# EAGLE design rt-board (EAGLE 5.10)
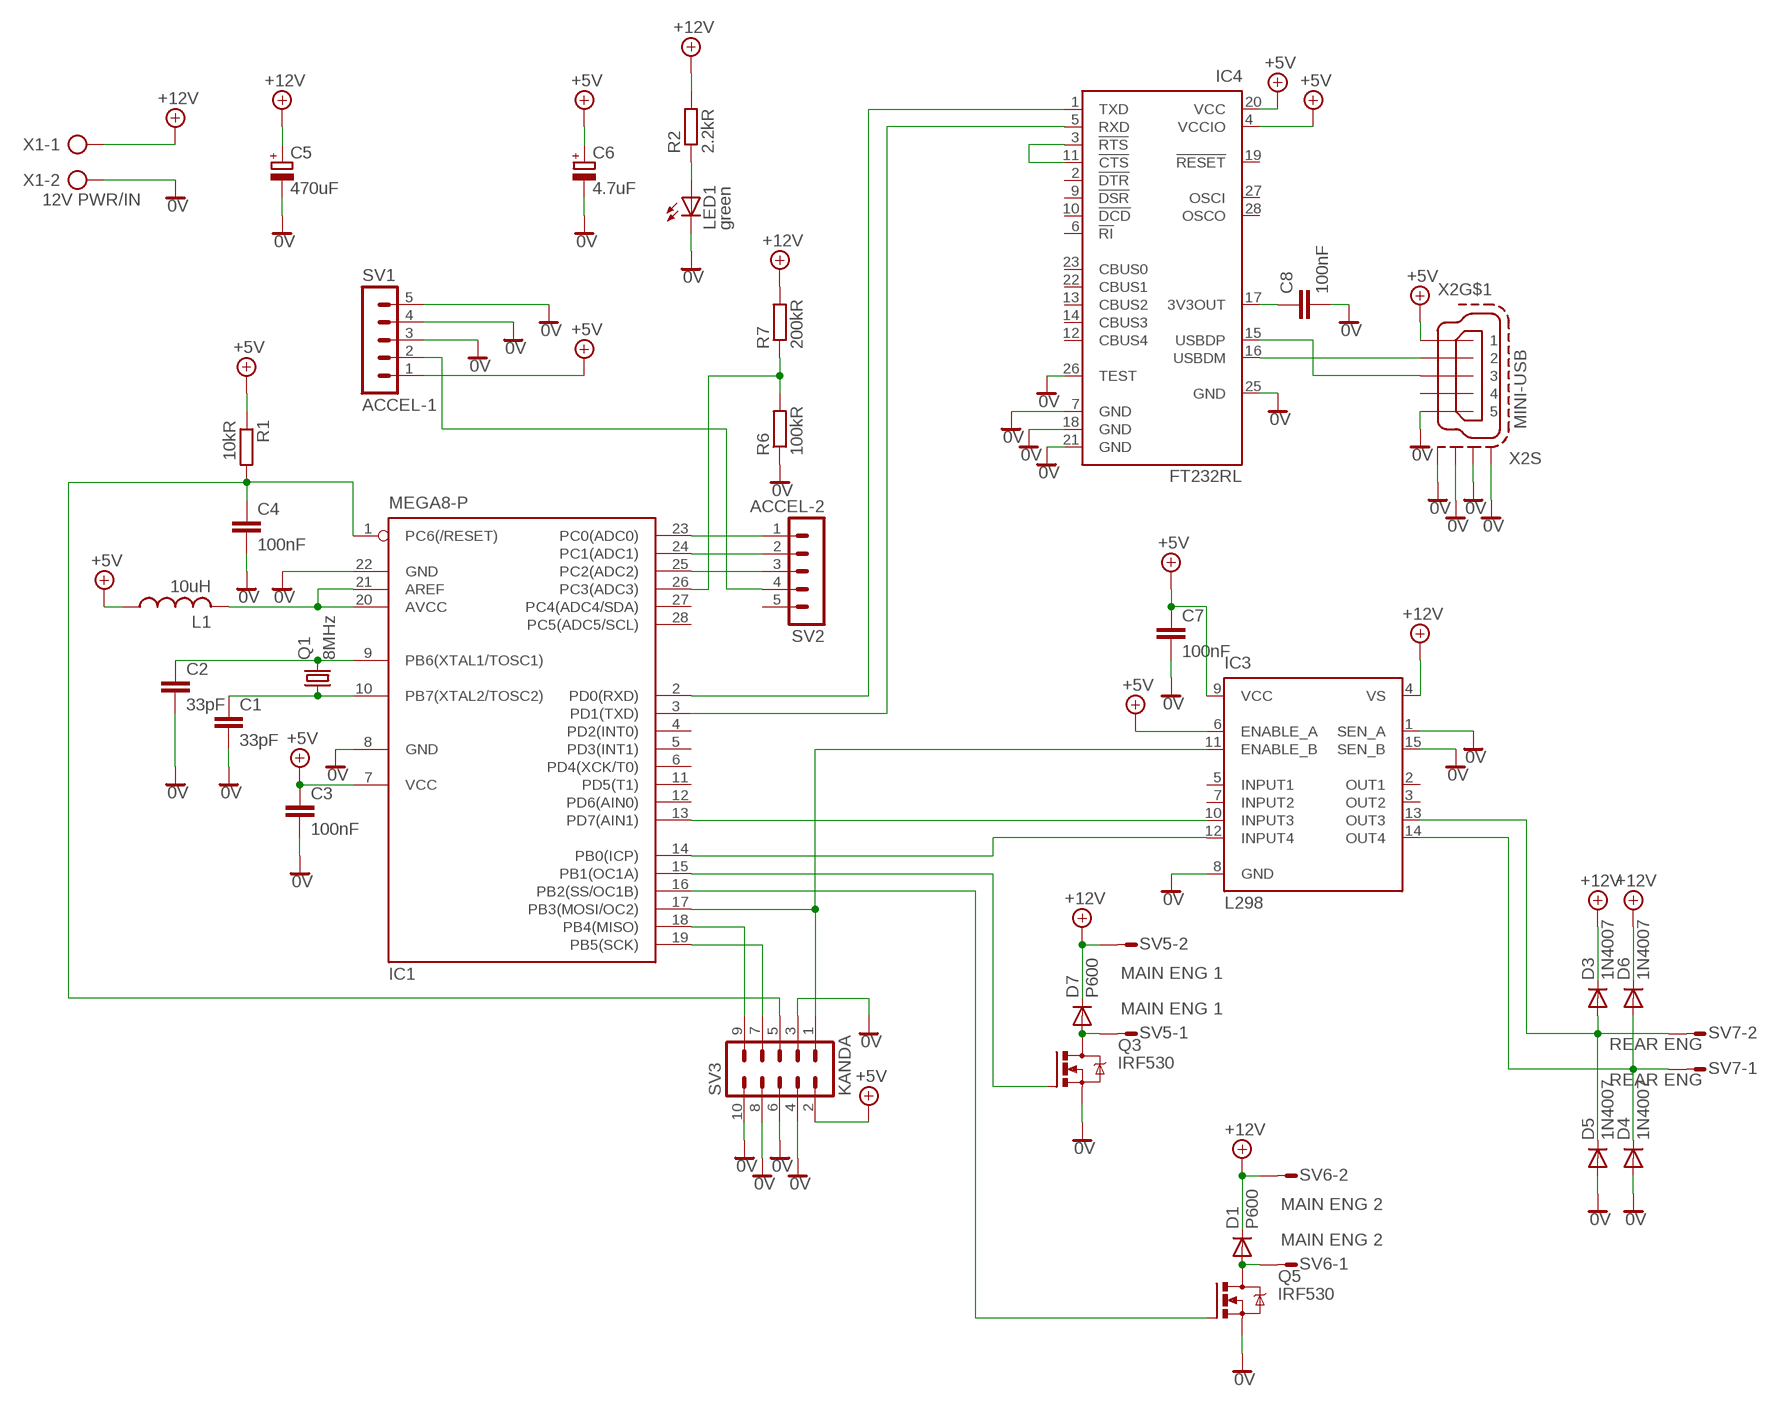
[diagram p0: schematic, sheet 1]

## Parts
C1  33pF  C-EU050-024X044  [C050-024X044]
C2  33pF  C-EU050-024X044  [C050-024X044]
C3  100nF  C-EU050-024X044  [C050-024X044]
C4  100nF  C-EU050-024X044  [C050-024X044]
C5  470uF  CPOL-EUE3.5-10  [E3,5-10]
C6  4.7uF  CPOL-EUE2-4  [E2-4]
C7  100nF  C-EU050-024X044  [C050-024X044]
C8  100nF  C-EUC0603  [C0603]
D1  P600  [P6-15]
D3  1N4007  1N4446  [DO35-10]
D4  1N4007  1N4446  [DO35-10]
D5  1N4007  1N4446  [DO35-10]
D6  1N4007  1N4446  [DO35-10]
D7  P600  [P6-15]
IC1  MEGA8-P  [DIL28-3]
IC3  L298  [MULTIWATT-15]
IC4  FT232RL  [SSOP28]
L1  10uH  L-US0204/7  [0204/7]
LED1  green  LED3MM  [LED3MM]
Q1  8MHz  CRYSTALHC49S  [HC49/S]
Q3  IRF530  [TO220BV]
Q5  IRF530  [TO220BV]
R1  10kR  R-EU_0204/5  [0204/5]
R2  2.2kR  R-EU_0204/5  [0204/5]
R6  100kR  R-EU_0204/5  [0204/5]
R7  200kR  R-EU_0204/5  [0204/5]
SV1  ACCEL-1  MA05-1  [MA05-1]
SV2  ACCEL-2  MA05-1  [MA05-1]
SV3  KANDA  ML10  [ML10]
SV5  MAIN ENG 1  S02P  [S02P]
SV6  MAIN ENG 2  S02P  [S02P]
SV7  REAR ENG  S02P  [S02P]
X1  12V PWR/IN  AK300/2  [AK300/2]
X2  MINI-USB  MINI-USB-SCHIELD-32005-201  [32005-201]

## Nets
0V: C1.2 C2.2 C3.2 C4.2 C5.- C6.- C7.2 C8.2 D4.A D5.A IC1.8(GND) IC1.22(GND) IC3.1(SEN_A) IC3.8(GND) IC3.15(SEN_B) IC4.7(GND) IC4.18(GND) IC4.21(GND) IC4.25(GND) IC4.26(TEST) LED1.K(C) Q3.S Q5.S R6.1 SV1.3 SV1.4 SV1.5 SV3.3 SV3.4 SV3.6 SV3.8 SV3.10 X1.2 X2.5 X2.M1(S:S1) X2.M2(S:S2) X2.M3(S:S3) X2.M4(S:S4)
+5V: C3.1 C6.+ C7.1 IC1.7(VCC) IC3.6(ENABLE_A) IC3.9(VCC) IC4.4(VCCIO) IC4.20(VCC) L1.1 R1.1 SV1.1 SV3.2 X2.1
+8V: C5.+ D1.C D3.C D6.C D7.C IC3.4(VS) R2.2 R7.2 SV5.2 SV6.2 X1.1 ; supply symbol labelled +12V
N$1: IC1.23(PC0(ADC0)) SV2.1
N$2: IC1.24(PC1(ADC1)) SV2.2
N$3: IC1.25(PC2(ADC2)) SV2.3
N$4: C2.1 IC1.9(PB6(XTAL1/TOSC1)) Q1.2
N$5: C1.1 IC1.10(PB7(XTAL2/TOSC2)) Q1.1
N$6: IC1.20(AVCC) IC1.21(AREF) L1.2
N$7: C4.1 IC1.1(PC6(/RESET)) R1.2 SV3.5
N$8: IC1.18(PB4(MISO)) SV3.9
N$9: IC1.19(PB5(SCK)) SV3.7
N$11: IC1.17(PB3(MOSI/OC2)) IC3.11(ENABLE_B) SV3.1
N$13: IC1.2(PD0(RXD)) IC4.1(TXD)
N$14: IC1.3(PD1(TXD)) IC4.5(RXD)
N$15: D7.A Q3.D SV5.1
N$16: D3.A D5.C IC3.13(OUT3) SV7.2
N$17: D4.C D6.A IC3.14(OUT4) SV7.1
N$18: IC1.16(PB2(SS/OC1B)) Q5.G
N$19: IC1.15(PB1(OC1A)) Q3.G
N$20: IC1.14(PB0(ICP)) IC3.12(INPUT4)
N$21: IC1.13(PD7(AIN1)) IC3.10(INPUT3)
N$22: SV1.2 SV2.4
N$23: LED1.A R2.1
N$24: IC1.26(PC3(ADC3)) R6.2 R7.1
N$25: C8.1 IC4.17(3V3OUT)
N$26: IC4.3(!RTS) IC4.11(!CTS)
N$27: IC4.16(USBDM) X2.2
N$28: IC4.15(USBDP) X2.3
N$30: D1.A Q5.D SV6.1
Unconnected: IC1.4(PD2(INT0)) IC1.5(PD3(INT1)) IC1.6(PD4(XCK/T0)) IC1.11(PD5(T1)) IC1.12(PD6(AIN0)) IC1.27(PC4(ADC4/SDA)) IC1.28(PC5(ADC5/SCL)) IC3.2(OUT1) IC3.3(OUT2) IC3.5(INPUT1) IC3.7(INPUT2) IC4.2(!DTR) IC4.6(!RI) IC4.9(!DSR) IC4.10(!DCD) IC4.12(CBUS4) IC4.13(CBUS2) IC4.14(CBUS3) IC4.19(!RESET) IC4.22(CBUS1) IC4.23(CBUS0) IC4.27(OSCI) IC4.28(OSCO) SV2.5 X2.4

## Library data of the parts
C1-C4 C7 C8 = rcl:C-EU: CAPACITOR, European symbol
C5 C6 = rcl:CPOL-EU: POLARIZED CAPACITOR, European symbol
D1 D7 = diode:P600: DIODE high voltage diode, silicon rectifier 1.0 A to 6.0 A, 50 V to 1300 V http://www.kosemi.com/product/diosr.html
D3-D6 = diode:1N4446: DIODE high speed (Philips)
IC1 = atmel:MEGA8-P: MICROCONTROLLER 8 Kbytes FLASH, 1 kbytes SRAM, 512 bytes EEPROM, USART, 4-channel 10 bit ADC, 2-channel 8 bit ADC Pin compatible with Atmega48, ATMega88, ATMega168 Source: avr.lbr; OC_FARNELL: unknown; OC_NEWARK: unknown
IC3 = st-microelectronics:L298: DUAL FULL-BRIDGE DRIVER
IC4 = ftdichip:FT232R: Source: http://www.ftdichip.com/Documents/DataSheets/DS_FT232R_v104.pdf
L1 = rcl:L-US: INDUCTOR, American symbol
LED1 = led:LED: LED OSRAM: - CHIPLED LG R971, LG N971, LY N971, LG Q971, LY Q971, LO R971, LY R971 LH N974, LH R974 LS Q976, LO Q976, LY Q976 LO Q996 - Hyper CHIPLED LW Q18S LB Q993, LB Q99A, LB R99A - SideLED LS A670, LO A670, LY A670, LG A670, LP A670 LB A673, LV A673, LT A673, LW A673 LH A674 LY A675 LS A676, LA A676, LO A676, LY A676, LW A676 LS A679, LY A679, LG A679 - Hyper Micro SIDELED® LS Y876, LA Y876, LO Y876, LY Y876 LT Y87S - SmartLED LW L88C, LW L88S LB L89C, LB L89S, LG L890 LS L89K, LO L89K, LY L89K LS L896, LA L896, LO L896, LY L896 - TOPLED LS T670, LO T670, LY T670, LG T670, LP T670 LSG T670, LSP T670, LSY T670, LOP T670, LYG T670 LG T671, LOG T671, LSG T671 LB T673, LV T673, LT T673, LW T673 LH T674 LS T676, LA T676, LO T676, LY T676, LB T676, LH T676, LSB T676, LW T676 LB T67C, LV T67C, LT T67C, LS T67K, LO T67K, LY T67K, LW E67C LS E67B, LA E67B, LO E67B, LY E67B, LB E67C, LV E67C, LT E67C LW T67C LS T679, LY T679, LG T679 LS T770, LO T770, LY T770, LG T770, LP T770 LB T773, LV T773, LT T773, LW T773 LH T774 LS E675, LA E675, LY E675, LS T675 LS T776, LA T776, LO T776, LY T776, LB T776 LHGB T686 LT T68C, LB T68C - Hyper Mini TOPLED® LB M676 - Mini TOPLED Santana® LG M470 LS M47K, LO M47K, LY M47K Source: http://www.osram.convergy.de LUXEON: - LUMILED® LXK2-PW12-R00, LXK2-PW12-S00, LXK2-PW14-U00, LXK2-PW14-V00 LXK2-PM12-R00, LXK2-PM12-S00, LXK2-PM14-U00 LXK2-PE12-Q00, LXK2-PE12-R00, LXK2-PE12-S00, LXK2-PE14-T00, LXK2-PE14-U00 LXK2-PB12-K00, LXK2-PB12-L00, LXK2-PB12-M00, LXK2-PB14-N00, LXK2-PB14-P00, LXK2-PB14-Q00 LXK2-PR12-L00, LXK2-PR12-M00, LXK2-PR14-Q00, LXK2-PR14-R00 LXK2-PD12-Q00, LXK2-PD12-R00, LXK2-PD12-S00 LXK2-PH12-R00, LXK2-PH12-S00 LXK2-PL12-P00, LXK2-PL12-Q00, LXK2-PL12-R00 Source: www.luxeon.com KINGBRIGHT: KA-3528ASYC Source: www.kingbright.com
Q1 = crystal:CRYSTAL: CRYSTAL; OC_FARNELL: 1667008; OC_NEWARK: unknown
Q3 Q5 = transistor-power:IRF530: HEXFET Power MOSFET
R1 R2 R6 R7 = rcl:R-EU_: RESISTOR, European symbol
SV1 SV2 = con-lstb:MA05-1: PIN HEADER; OC_FARNELL: unknown; OC_NEWARK: unknown
SV3 = con-harting-ml:ML10: HARTING; OC_FARNELL: unknown; OC_NEWARK: unknown
SV5-SV7 = con-amp-mt:S02P: AMP MT CONNECTOR
X1 = con-ptr500:AK300/2: CONNECTOR; OC_FARNELL: unknown; OC_NEWARK: unknown
X2 = con-cypressindustries:MINI-USB-SCHIELD-: MINI USB-B Conector Source: www.cypressindustries.com

## Board
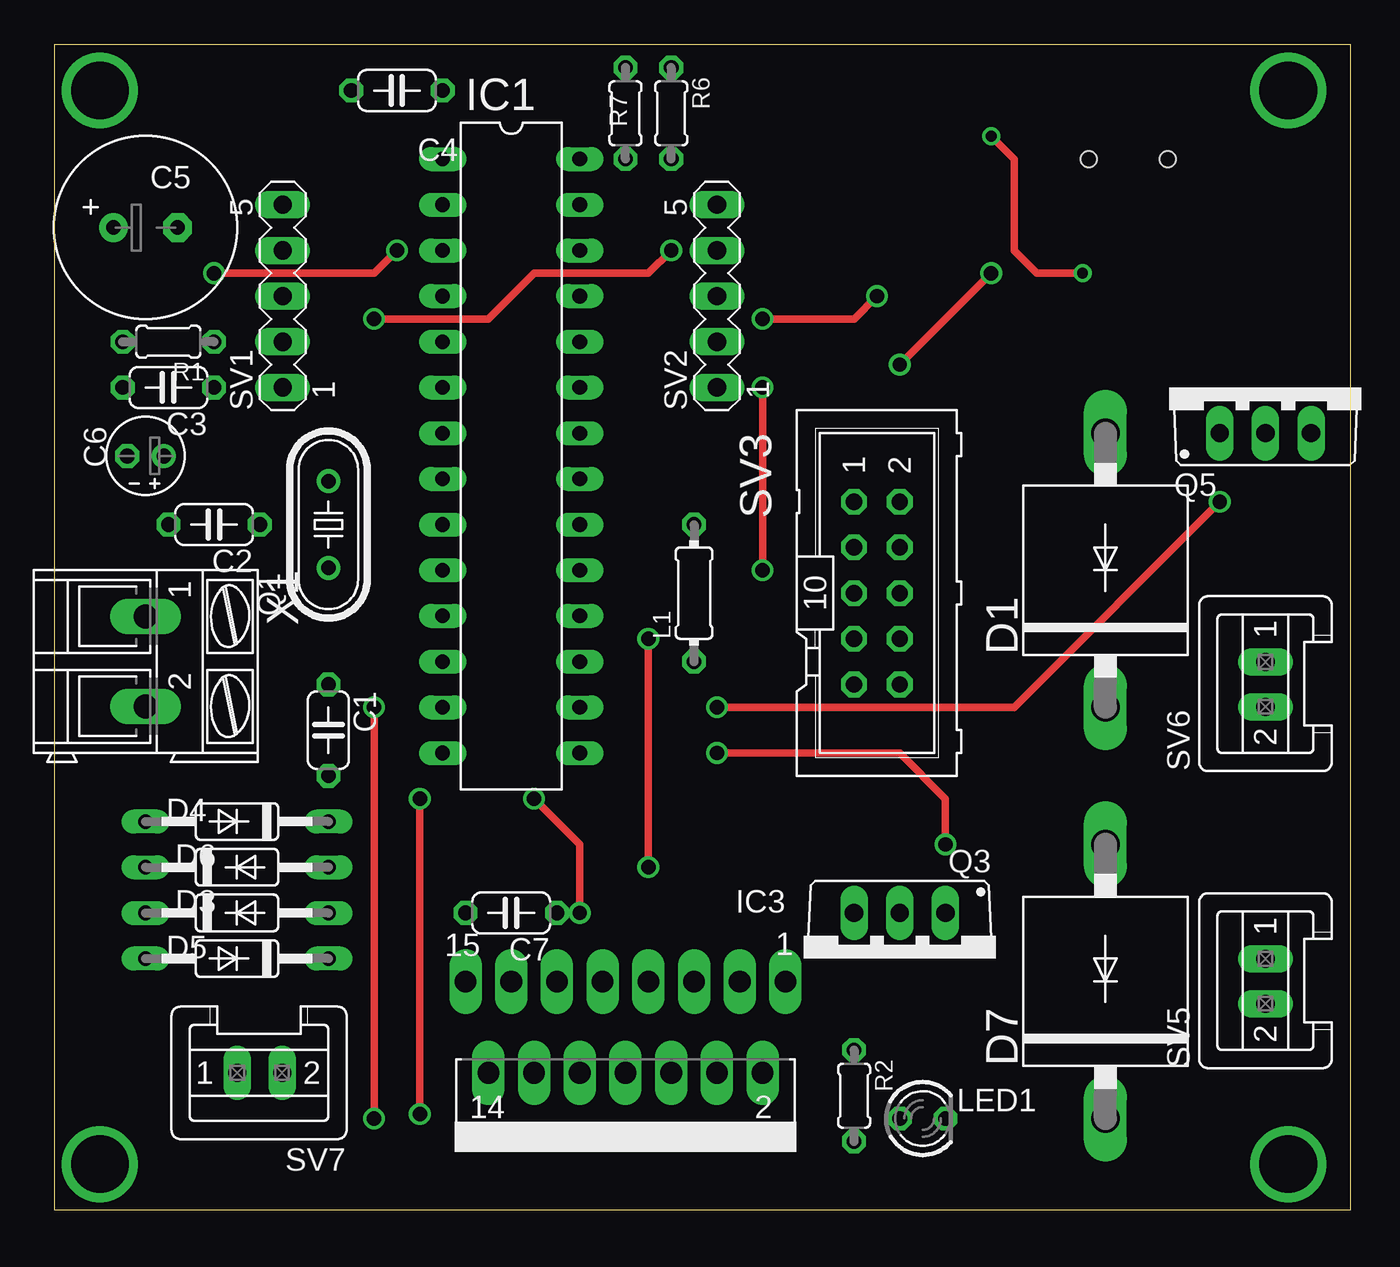
[diagram p1: board, top side]
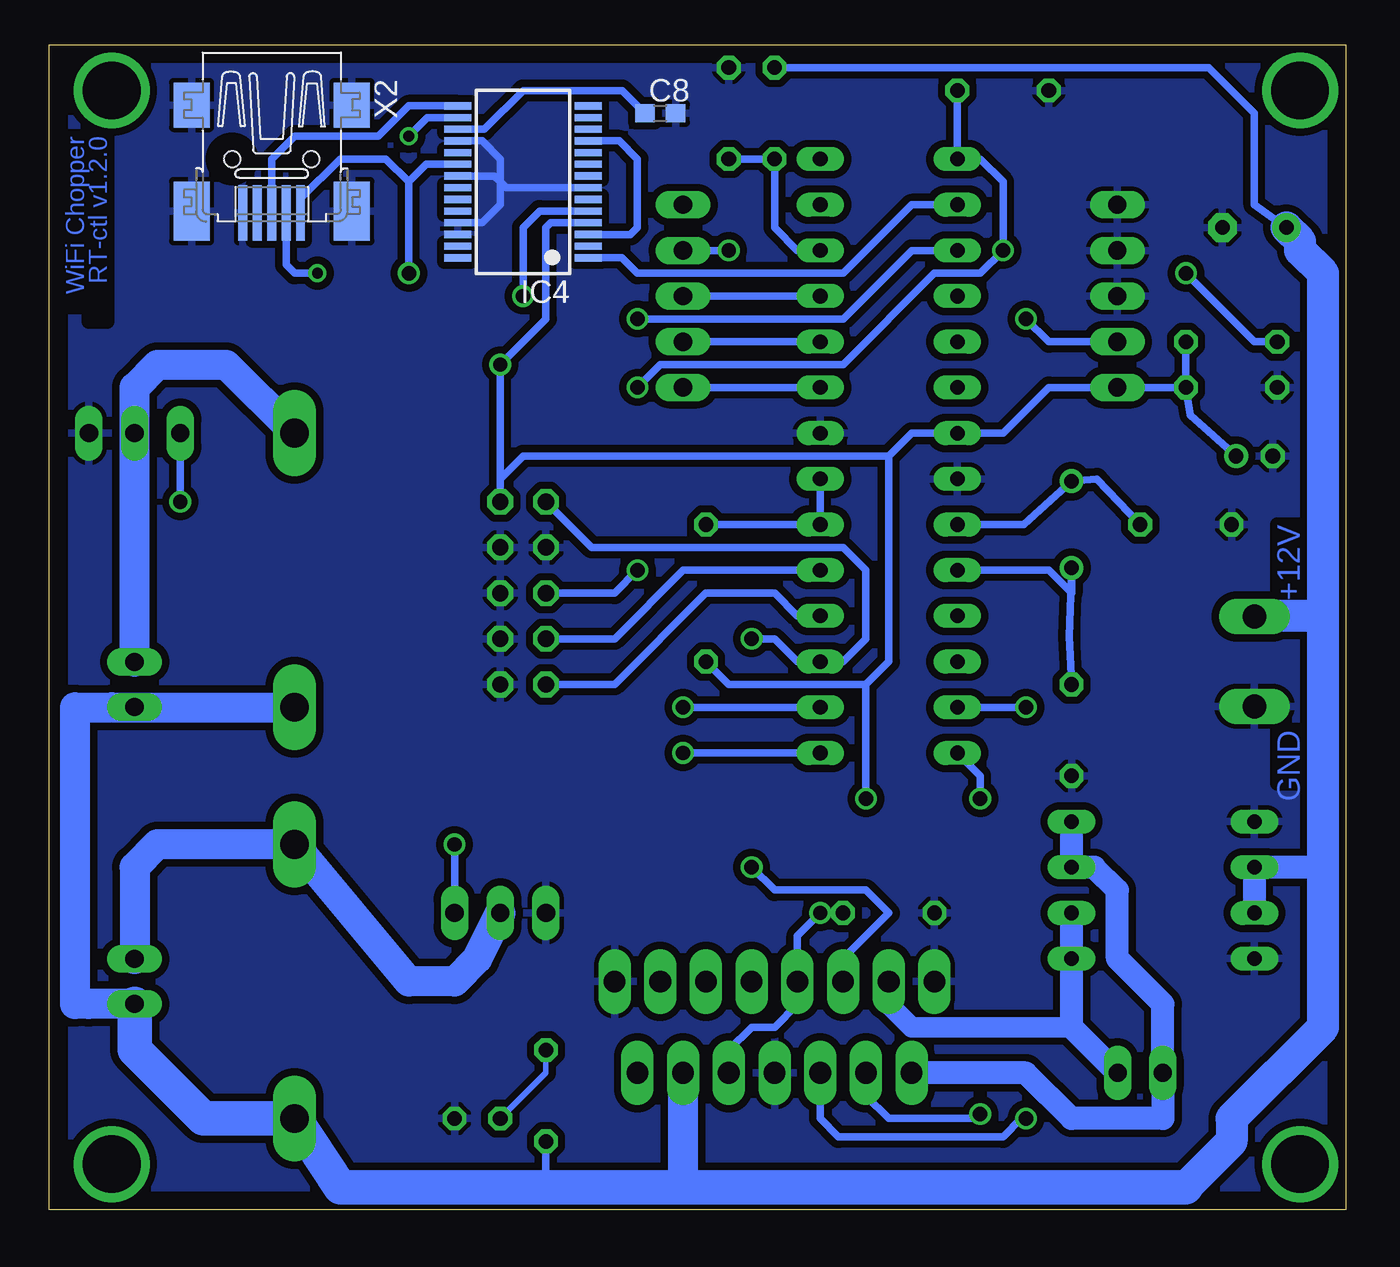
[diagram p2: board, bottom side, seen from below]

Size 72.06 x 64.76 mm. Coordinates in mm from the lower left corner, seen from the top.
Outline: 0,0 72.06,0 72.06,64.76 0,64.76 0,0
Copper layers (1*16): Top 0.035mm / dielectric 1.5mm / Bottom 0.035mm
Design rules "default": minimum track width 10mil, minimum drill 24mil, track to track 8mil, track to pad 8mil, pad to pad 8mil, via to via 8mil, smd to smd 8mil, copper to edge 40mil, drill to drill 8mil, minimum pad ring 10mil, minimum via ring 8mil, stop-mask expansion 4mil, vias tented up to drill 0mil, thermal gap 10mil

### Footprints (pad centres in the part's own frame; a part is rotated, then mirrored left to right if it is on the bottom)
C050-024X044 = drill 0.813 octagon: 1 -2.54,0; 2 2.54,0
E3,5-10 = drill 0.813 pad 1.6 round: + -1.778,0 | drill 0.813 pad 1.6 octagon: - 1.778,0
E2-4 = drill 0.813 pad 1.27 round: + -1.016,0 | drill 0.813 pad 1.27 octagon: - 1.016,0
C0603 = smd 1.1 x 1: 1 -0.85,0; 2 0.85,0
P6-15 = drill 1.6 long: A 7.62,0; C -7.62,0
DO35-10 = drill 0.813 long: A 5.08,0; C -5.08,0
DIL28-3 = drill 0.813 long: 1 -16.51,-3.81; 2 -13.97,-3.81; 3 -11.43,-3.81; 4 -8.89,-3.81; 5 -6.35,-3.81; 6 -3.81,-3.81; 7 -1.27,-3.81; 8 1.27,-3.81; 9 3.81,-3.81; 10 6.35,-3.81; 11 8.89,-3.81; 12 11.43,-3.81; 13 13.97,-3.81; 14 16.51,-3.81; 15 16.51,3.81; 16 13.97,3.81; 17 11.43,3.81; 18 8.89,3.81; 19 6.35,3.81; 20 3.81,3.81; 21 1.27,3.81; 22 -1.27,3.81; 23 -3.81,3.81; 24 -6.35,3.81; 25 -8.89,3.81; 26 -11.43,3.81; 27 -13.97,3.81; 28 -16.51,3.81
MULTIWATT-15 = drill 1.2 long: 1 -8.89,-7.62; 2 -7.62,-2.54; 3 -6.35,-7.62; 4 -5.08,-2.54; 5 -3.81,-7.62; 6 -2.54,-2.54; 7 -1.27,-7.62; 8 0,-2.54; 9 1.27,-7.62; 10 2.54,-2.54; 11 3.81,-7.62; 12 5.08,-2.54; 13 6.35,-7.62; 14 7.62,-2.54; 15 8.89,-7.62
SSOP28 = smd 0.4 x 1.5: 1 -4.225,-3.625; 2 -3.575,-3.625; 3 -2.925,-3.625; 4 -2.275,-3.625; 5 -1.625,-3.625; 6 -0.975,-3.625; 7 -0.325,-3.625; 8 0.325,-3.625; 9 0.975,-3.625; 10 1.625,-3.625; 11 2.275,-3.625; 12 2.925,-3.625; 13 3.575,-3.625; 14 4.225,-3.625; 15 4.225,3.625; 16 3.575,3.625; 17 2.925,3.625; 18 2.275,3.625; 19 1.625,3.625; 20 0.975,3.625; 21 0.325,3.625; 22 -0.325,3.625; 23 -0.975,3.625; 24 -1.625,3.625; 25 -2.275,3.625; 26 -2.925,3.625; 27 -3.575,3.625; 28 -4.225,3.625
0204/7 = drill 0.813 octagon: 1 -3.81,0; 2 3.81,0
LED3MM = drill 0.813 octagon: A -1.27,0; K 1.27,0
HC49/S = drill 0.813 round: 1 -2.413,0; 2 2.413,0
TO220BV = drill 1.016 long: D 0,-2.54; G -2.54,-2.54; S 2.54,-2.54
0204/5 = drill 0.813 octagon: 1 -2.54,0; 2 2.54,0
MA05-1 = drill 1.016 long: 1 -5.08,0; 2 -2.54,0; 3 0,0; 4 2.54,0; 5 5.08,0
ML10 = drill 0.914 octagon: 1 -5.08,-1.27; 2 -5.08,1.27; 3 -2.54,-1.27; 4 -2.54,1.27; 5 0,-1.27; 6 0,1.27; 7 2.54,-1.27; 8 2.54,1.27; 9 5.08,-1.27; 10 5.08,1.27
S02P = drill 1.016 long: 1 1.25,0; 2 -1.25,0
AK300/2 = drill 1.321 long: 1 -2.515,0; 2 2.489,0
32005-201 = smd 3.1 x 0.5: 1 3,1.6; 2 3,0.8; 3 3,0; 4 3,-0.8; 5 3,-1.6 | smd 2.5 x 2: M1 -3,-4.45; M2 -3,4.45 | smd 3.3 x 2: M3 2.9,4.45; M4 2.9,-4.45 | hole 0.9: 0,2.2; 0,-2.2

### Placement (x,y rotation side)
C1  15.24,26.67 270 top
C2  8.89,38.1 180 top
C3  6.35,45.72 180 top
C4  19.05,62.23 180 top
C5  5.08,54.61 0 top
C6  5.08,41.91 180 top
C7  25.4,16.51 180 top
C8  38.1,60.96 0 bottom
D1  58.42,35.56 90 top
D3  10.16,16.51 0 top
D4  10.16,21.59 180 top
D5  10.16,13.97 180 top
D6  10.16,19.05 0 top
D7  58.42,12.7 90 top
IC1  25.4,41.91 270 top
IC3  31.75,5.08 180 top
IC4  45.72,57.15 90 bottom
L1  35.56,34.29 90 top
LED1  48.26,5.08 0 top
Q1  15.24,38.1 90 top
Q3  46.99,13.97 180 top
Q5  67.31,45.72 0 top
R1  6.35,48.26 180 top
R2  44.45,6.35 270 top
R6  34.29,60.96 270 top
R7  31.75,60.96 90 top
SV1  12.7,50.8 90 top
SV2  36.83,50.8 90 top
SV3  45.72,34.29 270 top
SV5  67.31,12.7 90 top
SV6  67.31,29.21 90 top
SV7  11.43,7.62 180 top
X1  5.08,30.48 270 top
X2  59.69,58.42 270 bottom

### Tracks (layer width: path | path; a pad name or v marks a point on that pad's centre or on a via)
0V
  Bottom 0.406: IC4.21 47.32,57.48 46.99,57.15 | 46.99,57.15 46.99,55.88 47.99,54.88 IC4.25 | IC4.7 46.66,56.83 46.99,57.15 | IC4.18 47.99,59.43 46.99,58.42 46.99,57.15
  pour Bottom (isolate 0.406): 0,64.77 0,0 71.12,0 71.12,64.77
+5V  (via drill 0.8)
  Top 0.406: v29.21,16.51 29.21,20.32 v26.67,22.86 | v46.99,46.99 v52.07,52.07
  Bottom 0.406: C3.1 SV1.1 16.51,45.72 19.05,43.18 IC1.7 24.13,43.18 25.4,41.91 | C3.1 R1.1 | IC3.6 34.29,8.89 33.02,10.16 31.75,10.16 30.48,11.43 IC3.9 30.48,15.24 v29.21,16.51 C7.1 | 6.35,42.16 C6.+ 8.64,44.2 C3.1 | L1.1 34.29,29.21 26.67,29.21 | v26.67,22.86 26.67,29.21 | 25.4,41.91 25.4,30.48 26.67,29.21 | IC4.4 44.18,54.88 44.45,54.61 44.45,49.53 v46.99,46.99 SV3.2 46.99,40.64 45.72,41.91 25.4,41.91 | IC4.20 51.1,58.12 52.07,57.15 | v52.07,52.07 52.07,57.15 | X2.1 58.09,56.21 55.88,58.42 53.34,58.42 52.07,57.15
+8V
  Bottom 0.406: R7.2 7.62,63.5 5.08,60.96 5.08,55.88 C5.+ | 44.45,1.27 R2.2
  Bottom 1.27: D3.C D6.C 1.27,19.05 | 68.6,27.94 SV6.2 68.56,27.94
  Bottom 1.676: 36.83,1.27 IC3.4 | SV5.2 69.87,11.45 70.61,11.43 70.61,27.94 68.6,27.94 | 68.56,27.94 D1.C
  Bottom 1.778: C5.+ 2.54,53.85 2.54,53.34 1.27,52.07 1.27,33.02 | 1.27,33.02 1.27,19.05 1.27,10.16 6.35,5.08 6.35,3.81 8.89,1.27 | 1.27,33.02 3.81,33.02 | 3.81,33.02 5.08,33.02 | X1.1 3.84,32.99 3.81,33.02
  Bottom 1.93: 8.89,1.27 36.83,1.27 44.45,1.27 55.88,1.27 D7.C 63.5,5.08 67.31,8.89 SV5.2
N$1
  Bottom 0.406: IC1.23 SV2.1
N$2
  Bottom 0.406: IC1.24 SV2.2
N$3
  Bottom 0.406: IC1.25 SV2.3
N$4
  Bottom 0.406: IC1.9 17.91,38.1 Q1.2 13.84,40.64 C2.1
N$5
  Bottom 0.406: IC1.10 16.51,35.56 15.24,34.29 Q1.1 15.37,31.88 C1.1
N$6
  Bottom 0.406: IC1.21 IC1.20 L1.2
N$7  (via drill 0.8)
  Top 0.406: v39.37,45.72 v39.37,35.56 | v8.89,52.07 17.78,52.07 v19.05,53.34
  Bottom 0.406: C4.1 IC1.1 20.32,58.42 19.05,57.15 v19.05,53.34 20.32,52.07 22.86,52.07 27.94,46.99 38.1,46.99 v39.37,45.72 | SV3.5 40.64,34.29 v39.37,35.56 | R1.2 5.08,48.26 v8.89,52.07
N$8
  Bottom 0.406: IC1.18 30.48,33.02 31.75,34.29 35.56,34.29 40.64,29.21 SV3.9
N$9
  Bottom 0.406: SV3.7 40.64,31.75 36.83,35.56 IC1.19
N$11  (via drill 0.8)
  Top 0.406: v33.02,19.05 v33.02,31.75
  Bottom 0.406: SV3.1 41.91,36.83 27.94,36.83 26.67,35.56 26.67,31.75 27.94,30.48 IC1.17 30.48,30.48 31.75,31.75 v33.02,31.75 | IC3.11 27.94,13.97 25.4,16.51 26.67,17.78 31.75,17.78 v33.02,19.05
N$13
  Bottom 0.406: IC1.2 24.13,55.88 27.94,52.07 39.37,52.07 40.23,52.93 IC4.1
N$14  (via drill 0.8)
  Top 0.406: v45.72,50.8 44.45,49.53 v39.37,49.53
  Bottom 0.406: IC1.3 24.13,53.34 27.94,49.53 v39.37,49.53 | IC4.5 44.8,55.53 45.72,54.61 v45.72,50.8
N$15
  Bottom 1.676: SV5.1 67.31,19.05 66.04,20.32 D7.A 52.07,12.7 49.53,12.7 48.26,13.97 Q3.D
N$16
  Bottom 1.143: IC3.13 25.4,11.43 24.13,10.16 15.24,10.16
  Bottom 1.27: D3.A D5.C 15.24,10.16 12.7,7.62 SV7.2
N$17
  Bottom 1.27: D4.C D6.A 13.97,19.05 12.7,17.78 12.7,13.97 10.16,11.43 10.18,11.41 SV7.1 10.16,7.6 10.16,5.08 15.24,5.08 17.78,7.62 IC3.14
N$18  (via drill 0.8)
  Top 0.406: v36.83,27.94 53.34,27.94 v64.77,39.37
  Bottom 0.406: IC1.16 v36.83,27.94 | v64.77,39.37 Q5.G
N$19  (via drill 0.8)
  Top 0.406: v36.83,25.4 46.99,25.4 49.53,22.86 v49.53,20.32
  Bottom 0.406: IC1.15 v36.83,25.4 | v49.53,20.32 Q3.G
N$20  (via drill 0.8)
  Top 0.406: v20.32,5.33 v20.32,22.86
  Bottom 0.406: v20.32,22.86 20.32,24.13 IC1.14 | IC3.12 26.67,6.35 25.4,5.08 20.57,5.08 v20.32,5.33
N$21  (via drill 0.8)
  Top 0.406: v17.78,5.08 v17.78,27.94
  Bottom 0.406: v17.78,27.94 IC1.13 | IC3.10 29.21,5.08 28.19,4.06 19.05,4.06 18.03,5.08 v17.78,5.08
N$22  (via drill 0.8)
  Top 0.406: v17.78,49.53 24.13,49.53 26.67,52.07 33.02,52.07 v34.29,53.34
  Bottom 0.406: SV1.2 16.51,48.26 v17.78,49.53 | v34.29,53.34 SV2.4
N$23
  Bottom 0.305: LED1.A 44.45,7.62 R2.1
N$24
  Bottom 0.406: IC1.26 30.48,53.34 31.75,54.61 R7.1 R6.2
N$25
  Bottom 0.406: IC4.17 47.88,60.08 45.72,62.23 40.22,62.23 C8.1
N$26
  Bottom 0.406: IC4.11 40.38,59.43 39.37,58.42 39.37,54.61 39.76,54.23 IC4.3
N$27  (via drill 0.6)
  Top 0.406: v57.15,52.07 54.61,52.07 53.34,53.34 53.34,58.42 v52.07,59.69
  Bottom 0.406: X2.2 58.89,52.54 58.42,52.07 v57.15,52.07 | IC4.16 51.04,60.73 v52.07,59.69
N$28
  Bottom 0.406: X2.3 59.69,58.42 58.42,59.69 53.77,59.69 52.09,61.38 IC4.15
N$30
  Bottom 1.676: D1.A 62.23,46.99 66.04,46.99 67.31,45.72 Q5.D SV6.1
N$34  (via drill 3.2 pad 3.81)
  other vias: 2.54,62.23
N$35  (via drill 3.2 pad 3.81)
  other vias: 68.58,62.23
N$36  (via drill 3.2 pad 3.81)
  other vias: 68.58,2.54
N$37  (via drill 3.2 pad 3.81)
  other vias: 2.54,2.54

### Text on the board
Bottom: RT-ctl v1.2.0 | WiFi Chopper | +12V | GND